# Altium project 2m_DBoard_RX.PrjPcb (part 2 of 2)

## Sheet IF_RX.SchDoc: {Наименование}
size 420 x 297 mm; DocumentNumber: НРДЦ.ХХХХХХ.ХХХ ХХ; SheetNumber: {}; SheetTotal: {}; PageSetup: Record=PageOptions|CenterHorizontal=False|CenterVertical=False|PrintScale=0.95|XCorrection=0.00|YCorrection=0.00|PrintKind=1|BorderSize=5000000|LeftOffset=0|BottomOffset=0|Orientation=1|PaperLength=1000|PaperWidth=1000|Scale=100|PaperSource=15|PrintQuality=600|MediaType=1|DitherType=10|PaperKind=A4|PrintScaleMode=1; Rule: PcbType=ProtelPcb
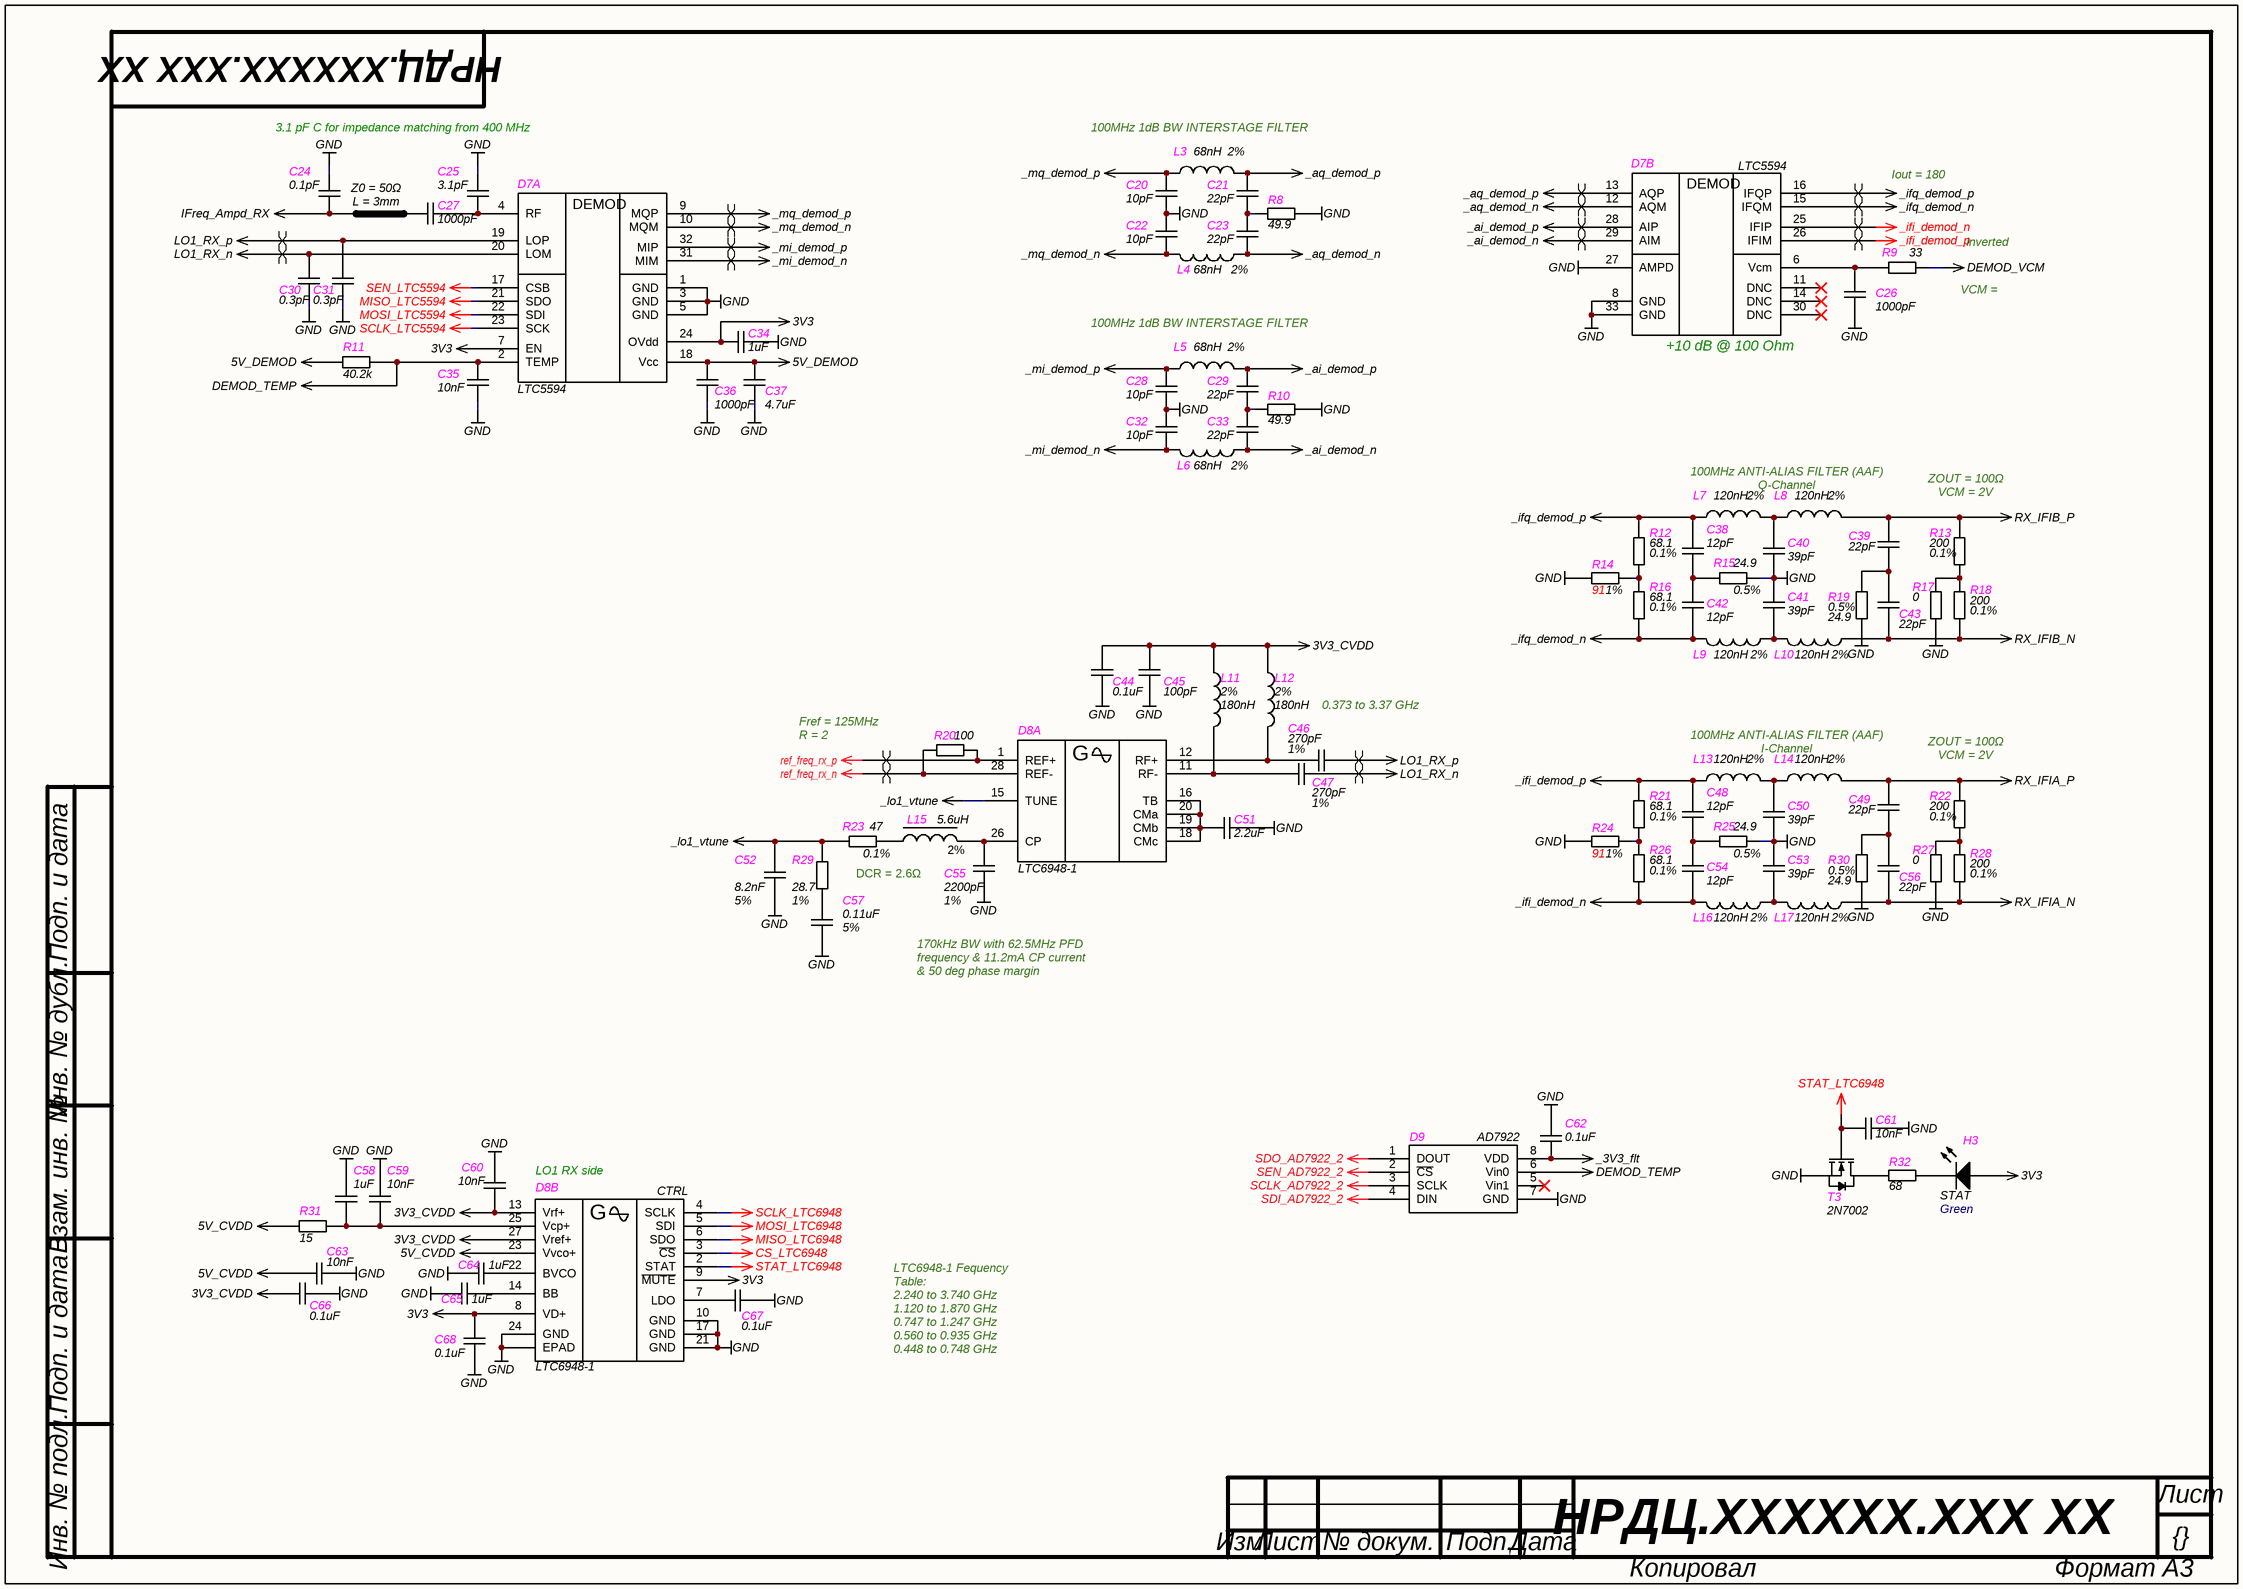
[diagram p3: IF_RX.SchDoc]

### Parts
C20  value 10pF  [C0402]  (hidden comment: CAP)
C21  value 22pF  [C0402]  (hidden comment: CAP)
C22  value 10pF  [C0402]  (hidden comment: CAP)
C23  value 22pF  [C0402]  (hidden comment: CAP)
C24  value 0.1pF  [C0402]  (hidden comment: CAP)
C25  value 3.1pF  [C0402]  (hidden comment: CAP)
C26  value 1000pF  [C0402]  (hidden comment: CAP)
C27  value 1000pF  [C0402]  (hidden comment: CAP)
C28  value 10pF  [C0402]  (hidden comment: CAP)
C29  value 22pF  [C0402]  (hidden comment: CAP)
C30  value 0.3pF  [C0402]  (hidden comment: CAP)
C31  value 0.3pF  [C0402]  (hidden comment: CAP)
C32  value 10pF  [C0402]  (hidden comment: CAP)
C33  value 22pF  [C0402]  (hidden comment: CAP)
C34  value 1uF  [C0402]  (hidden comment: CAP)
C35  value 10nF  [C0402]  (hidden comment: CAP)
C36  value 1000pF  [C0402]  (hidden comment: CAP)
C37  value 4.7uF  [C0805]  (hidden comment: CAP)
C38  value 12pF  [C0402]  (hidden comment: CAP)
C39  value 22pF  [C0402]  (hidden comment: CAP)
C40  value 39pF  [C0402]  (hidden comment: CAP)
C41  value 39pF  [C0402]  (hidden comment: CAP)
C42  value 12pF  [C0402]  (hidden comment: CAP)
C43  value 22pF  [C0402]  (hidden comment: CAP)
C44  value 0.1uF  [C0402]  (hidden comment: CAP)
C45  value 100pF  [C0402]  (hidden comment: CAP)
C46  value 270pF  Tolerance: 1%  [C0402]  (hidden comment: CAP)
C47  value 270pF  Tolerance: 1%  [C0402]  (hidden comment: CAP)
C48  value 12pF  [C0402]  (hidden comment: CAP)
C49  value 22pF  [C0402]  (hidden comment: CAP)
C50  value 39pF  [C0402]  (hidden comment: CAP)
C51  value 2.2uF  [C0603]  (hidden comment: CAP)
C52  value 8.2nF  Tolerance: 5%  [C0603]  (hidden comment: CAP)
C53  value 39pF  [C0402]  (hidden comment: CAP)
C54  value 12pF  [C0402]  (hidden comment: CAP)
C55  value 2200pF  Tolerance: 1%  [C0603]  (hidden comment: CAP)
C56  value 22pF  [C0402]  (hidden comment: CAP)
C57  value 0.11uF  Tolerance: 5%  [C0805]  (hidden comment: CAP)
C58  value 1uF  [C0402]  (hidden comment: CAP)
C59  value 10nF  [C0402]  (hidden comment: CAP)
C60  value 10nF  [C0402]  (hidden comment: CAP)
C61  value 10nF  [C0402]  (hidden comment: CAP)
C62  value 0.1uF  [C0402]  (hidden comment: CAP)
C63  value 10nF  [C0402]  (hidden comment: CAP)
C64  value 1uF  [C0402]  (hidden comment: CAP)
C65  value 1uF  [C0402]  (hidden comment: CAP)
C66  value 0.1uF  [C0402]  (hidden comment: CAP)
C67  value 0.1uF  [C0402]  (hidden comment: CAP)
C68  value 0.1uF  [C0402]  (hidden comment: CAP)
D7  LTC5594  [QFN-32]  (parts A,B of 2)
D8  LTC6948-1  [QFN-28]  (parts A,B of 2)
D9  AD7922  [MSOP-8]
H3  STAT  Color: Green  [LED_0805_Green]
L3  value 68nH  Tolerance: 2%  [L0402HPH]  (hidden comment: Inductor RF)
L4  value 68nH  Tolerance: 2%  [L0402HPH]  (hidden comment: Inductor RF)
L5  value 68nH  Tolerance: 2%  [L0402HPH]  (hidden comment: Inductor RF)
L6  value 68nH  Tolerance: 2%  [L0402HPH]  (hidden comment: Inductor RF)
L7  value 120nH  Tolerance: 2%  [L0402HPH]  (hidden comment: Inductor RF)
L8  value 120nH  Tolerance: 2%  [L0402HPH]  (hidden comment: Inductor RF)
L9  value 120nH  Tolerance: 2%  [L0402HPH]  (hidden comment: Inductor RF)
L10  value 120nH  Tolerance: 2%  [L0402HPH]  (hidden comment: Inductor RF)
L11  value 180nH  Tolerance: 2%  [L0603_HP]  (hidden comment: Inductor RF)
L12  value 180nH  Tolerance: 2%  [L0603_HP]  (hidden comment: Inductor RF)
L13  value 120nH  Tolerance: 2%  [L0402HPH]  (hidden comment: Inductor RF)
L14  value 120nH  Tolerance: 2%  [L0402HPH]  (hidden comment: Inductor RF)
L15  value 5.6uH  Tolerance: 2%  [L1008_LS]  (hidden comment: Inductor)
L16  value 120nH  Tolerance: 2%  [L0402HPH]  (hidden comment: Inductor RF)
L17  value 120nH  Tolerance: 2%  [L0402HPH]  (hidden comment: Inductor RF)
R8  value 49.9  [R0402]  (hidden comment: RES)
R9  value 33  [R0402]  (hidden comment: RES)
R10  value 49.9  [R0402]  (hidden comment: RES)
R11  value 40.2k  [R0402]  (hidden comment: RES)
R12  value 68.1  Tolerance: 0.1%  [R0402]  (hidden comment: RES)
R13  value 200  Tolerance: 0.1%  [R0402]  (hidden comment: RES)
R14  value 91  Tolerance: 1%  [R0402]  (hidden comment: RES)
R15  value 24.9  Tolerance: 0.5%  [R0402]  (hidden comment: RES)
R16  value 68.1  Tolerance: 0.1%  [R0402]  (hidden comment: RES)
R17  value 0  [R0402]  (hidden comment: RES)
R18  value 200  Tolerance: 0.1%  [R0402]  (hidden comment: RES)
R19  value 24.9  Tolerance: 0.5%  [R0402]  (hidden comment: RES)
R20  value 100  [R0402]  (hidden comment: RES)
R21  value 68.1  Tolerance: 0.1%  [R0402]  (hidden comment: RES)
R22  value 200  Tolerance: 0.1%  [R0402]  (hidden comment: RES)
R23  value 47  Tolerance: 0.1%  [R0402]  (hidden comment: RES)
R24  value 91  Tolerance: 1%  [R0402]  (hidden comment: RES)
R25  value 24.9  Tolerance: 0.5%  [R0402]  (hidden comment: RES)
R26  value 68.1  Tolerance: 0.1%  [R0402]  (hidden comment: RES)
R27  value 0  [R0402]  (hidden comment: RES)
R28  value 200  Tolerance: 0.1%  [R0402]  (hidden comment: RES)
R29  value 28.7  Tolerance: 1%  [R0402]  (hidden comment: RES)
R30  value 24.9  Tolerance: 0.5%  [R0402]  (hidden comment: RES)
R31  value 15  [R0603]  (hidden comment: RES)
R32  value 68  [R0402]  (hidden comment: RES)
T3  2N7002  [SOT-23]

### Nets
3V3: C34.1 C68.2 D7.7(EN) D7.24(OVdd) D8.8(VD+) D8.9(~{MUTE}) H3.2(A)
3V3_CVDD: C44.2 C45.2 C60.2 C66.2 D8.13(Vrf+) D8.27(Vref+) L11.2 L12.2
5V_CVDD: C63.1 D8.23(Vvco+) R31.2
5V_DEMOD: C36.1 C37.2 D7.18(Vcc) R11.1
_3V3_flt: C62.1 D9.8(VDD)
_ai_demod_n: C33.2 D7.29(AIM) L6.2
_ai_demod_p: C29.1 D7.28(AIP) L5.2
_aq_demod_n: C23.2 D7.12(AQM) L4.2
_aq_demod_p: C21.1 D7.13(AQP) L3.2
_ifi_demod_n: C54.2 D7.25(IFIP) L16.1 R26.2
_ifi_demod_p: C48.1 D7.26(IFIM) L13.1 R21.1
_ifq_demod_n: C42.2 D7.15(IFQM) L9.1 R16.2
_ifq_demod_p: C38.1 D7.16(IFQP) L7.1 R12.1
_lo1_vtune: C52.2 D8.15(TUNE) R23.2 R29.1
_mi_demod_n: C32.2 D7.31(MIM) L6.1
_mi_demod_p: C28.1 D7.32(MIP) L5.1
_mq_demod_n: C22.2 D7.10(MQM) L4.1
_mq_demod_p: C20.1 D7.9(MQP) L3.1
CS_LTC6948: D8.3(~{CS})
DEMOD_TEMP: C35.1 D7.2(TEMP) D9.6(Vin0) R11.2
DEMOD_VCM: R9.1
GND: C20.2 C22.1 C24.2 C25.2 C26.2 C28.2 C30.2 C31.2 C32.1 C34.2 C35.2 C36.2 C37.1 C40.2 C41.1 C44.1 C45.1 C50.2 C51.1 C52.1 C53.1 C55.1 C57.1 C58.1 C59.1 C60.1 C61.2 C62.2 C63.2 C64.1 C65.2 C66.1 C67.1 C68.1 D7.1(GND) D7.3(GND) D7.5(GND) D7.8(GND) D7.27(AMPD) D7.33(GND) D8.10(GND) D8.17(GND) D8.21(GND) D8.24(GND) D8.29(EPAD) D9.7(GND) R8.2 R10.2 R14.1 R15.2 R17.2 R19.2 R24.1 R25.2 R27.2 R30.2 T3.2(S)
IFreq_Ampd_RX: C24.1 C27.2
LO1_RX_n: C30.1 C47.2 D7.20(LOM)
LO1_RX_p: C31.1 C46.2 D7.19(LOP)
MISO_LTC5594: D7.21(SDO)
MISO_LTC6948: D8.6(SDO)
MOSI_LTC5594: D7.22(SDI)
MOSI_LTC6948: D8.5(SDI)
ref_freq_rx_n: D8.28(REF-) R20.1
ref_freq_rx_p: D8.1(REF+) R20.2
RX_IFIA_N: C56.2 L17.2 R28.2
RX_IFIA_P: C49.1 L14.2 R22.1
RX_IFIB_N: C43.2 L10.2 R18.2
RX_IFIB_P: C39.1 L8.2 R13.1
SCLK_AD7922_2: D9.3(SCLK)
SCLK_LTC5594: D7.23(SCK)
SCLK_LTC6948: D8.4(SCLK)
SDI_AD7922_2: D9.4(DIN)
SDO_AD7922_2: D9.1(DOUT)
SEN_AD7922_2: D9.2(~{CS})
SEN_LTC5594: D7.17(CSB)
STAT_LTC6948: C61.1 D8.2(STAT) T3.1(G)
NetC21_2: C21.2 C23.1 R8.1
NetC25_1: C25.1 C27.1 D7.4(RF)
NetC26_1: C26.1 D7.6(Vcm) R9.2
NetC29_2: C29.2 C33.1 R10.1
NetC38_2: C38.2 C42.1 R15.1
NetC39_2: C39.2 C43.1 R19.1
NetC40_1: C40.1 L7.2 L8.1
NetC41_2: C41.2 L9.2 L10.1
NetC46_1: C46.1 D8.12(RF+) L12.1
NetC47_1: C47.1 D8.11(RF-) L11.1
NetC48_2: C48.2 C54.1 R25.1
NetC49_2: C49.2 C56.1 R30.1
NetC50_1: C50.1 L13.2 L14.1
NetC51_2: C51.2 D8.16(TB) D8.18(CMc) D8.19(CMb) D8.20(CMa)
NetC53_2: C53.2 L16.2 L17.1
NetC55_2: C55.2 D8.26(CP) L15.2
NetC57_2: C57.2 R29.2
NetC58_2: C58.2 C59.2 D8.25(Vcp+) R31.1
NetC64_2: C64.2 D8.22(BVCO)
NetC65_1: C65.1 D8.14(BB)
NetC67_2: C67.2 D8.7(LDO)
NetH3_1: H3.1(K) R32.2
NetL15_1: L15.1 R23.1
NetR12_2: R12.2 R14.2 R16.1
NetR13_2: R13.2 R17.1 R18.1
NetR21_2: R21.2 R24.2 R26.1
NetR22_2: R22.2 R27.1 R28.1
NetR32_1: R32.1 T3.3(D)

Not connected (* = marked no-connect by the designer): D7 11(DNC)* 14(DNC)* 30(DNC)*; D9 5(Vin1)*

### Layout directives
differential pair: _ai_demod_n, _ai_demod_p, _aq_demod_n, _aq_demod_p, _ifi_demod_n, _ifi_demod_p, _ifq_demod_n, _ifq_demod_p, _mi_demod_n, _mi_demod_p, _mq_demod_n, _mq_demod_p, LO1_RX_n, LO1_RX_p, ref_freq_rx_n, ref_freq_rx_p

### Notes on the sheet
- 3.1 pF C for impedance matching from 400 MHz
- 100MHz 1dB BW INTERSTAGE FILTER Q-Channel
- Iout = 180 mA
- Z0 = 50Ω
  L = 3mm
- inverted
- (near R9) VCM = 2V
- 100MHz 1dB BW INTERSTAGE FILTER I-Channel
- 100MHz ANTI-ALIAS FILTER (AAF) Q-Channel
- ZOUT = 100Ω
  VCM = 2V
- 0.373 to 3.37 GHz
- (near R20) Fref = 125MHz
  R = 2
- 100MHz ANTI-ALIAS FILTER (AAF) I-Channel
- DCR = 2.6Ω
- 170kHz BW with 62.5MHz PFD frequency & 11.2mA CP current & 50 deg phase margin
- LO1 RX side
- LTC6948-1 Fequency Table:
  2.240 to 3.740 GHz
  1.120 to 1.870 GHz
  0.747 to 1.247 GHz
  0.560 to 0.935 GHz
  0.448 to 0.748 GHz
  0.373 to 0.623 GHz
- Подп. и дата
- Инв. № дубл.
- Взам. инв. №
- Инв. № подл.
- Лист
- Изм.
- № докум.
- Подп.
- Дата
- Копировал
- Формат А3
- (in symbol LTC5594, part A) DEMOD
- (in symbol LTC5594, part B) DEMOD; +10 dB @ 100 Ohm
- (in symbol LTC6948, part A) G
- (in symbol LTC6948, part B) CTRL; G

### Library data of the parts
C20 C22 C28 C32 = CAP: SMD Capacitor; Manufacturer: Murata; Material: NP0; Tolerance: 1%; Voltage: 50V; Type: Ceramic Capacitor; P/N: GRM1555C1H100FA01D; Supplier 1: Digi-key; Supplier Part Number 1: 490-6186-1-ND; Supplier 2: Mouser; Supplier Part Number 2: 81-GRM1555C1H100FA1D; Supplier 3: Farnell; Supplier Part Number 3: *
C21 C23 C29 C33 C39 C43 C49 C56 = CAP: SMD Capacitor; Manufacturer: Murata; Material: NP0; Tolerance: 1%; Voltage: 50V; Type: Ceramic Capacitor; P/N: GRM1555C1H220FA01D; Supplier 1: Digi-key; Supplier Part Number 1: 490-8589-1-ND; Supplier 2: Mouser; Supplier Part Number 2: 81-GRM1555C1H220FA1D; Supplier 3: Farnell; Supplier Part Number 3: *
C24 = CAP: SMD Capacitor; Manufacturer: Murata; Material: NP0; Tolerance: ±0.05pF; Voltage: 50V; Type: Ceramic Capacitor; P/N: GRM1555C1HR10WA01D; Supplier 1: Digi-key; Supplier Part Number 1: 490-6259-1-ND; Supplier 2: Mouser; Supplier Part Number 2: 81-GRM1555C1HR10WA1D; Supplier 3: Farnell; Supplier Part Number 3: *
C25 = CAP: SMD Capacitor; Manufacturer: Murata; Material: NP0; Tolerance: ±0.05pF; Voltage: 50V; Type: Ceramic Capacitor; P/N: GJM1555C1H3R1WB01D; Supplier 1: Digi-key; Supplier Part Number 1: 490-GJM1555C1H3R1WB01DCT-ND; Supplier 2: Mouser; Supplier Part Number 2: 81-GJM1555C1H3R1WB1D; Supplier 3: Farnell; Supplier Part Number 3: *
C26 C27 C36 = CAP: SMD Capacitor; Manufacturer: Murata; Material: NP0; Tolerance: 5%; Voltage: 50V; Type: Ceramic Capacitor; P/N: GRM1555C1H102JA01D; Supplier 1: Digi-key; Supplier Part Number 1: 490-3244-1-ND; Supplier 2: Mouser; Supplier Part Number 2: 81-GRM1555C1H102JA1D; Supplier 3: Farnell; Supplier Part Number 3: *
C30 C31 = CAP: SMD Capacitor; Manufacturer: Murata; Material: NP0; Tolerance: ±0.05pF; Voltage: 50V; Type: Ceramic Capacitor; P/N: GRM1555C1HR30WA01D; Supplier 1: Digi-key; Supplier Part Number 1: 490-6261-1-ND; Supplier 2: Mouser; Supplier Part Number 2: 81-GRM1555C1HR30WA1D; Supplier 3: Farnell; Supplier Part Number 3: *
C34 C58 C64 C65 = CAP: SMD Capacitor; Manufacturer: Murata; Material: X7R; Tolerance: 10%; Voltage: 6.3V; Type: Ceramic Capacitor; P/N: GRM155R70J105KA12J; Supplier 1: Digi-key; Supplier Part Number 1: 490-13339-1-ND; Supplier 2: Mouser; Supplier Part Number 2: 81-GRM155R70J105KA2J; Supplier 3: Farnell; Supplier Part Number 3: *
C35 C59-C61 C63 = CAP: SMD Capacitor; Manufacturer: Murata; Material: X7R; Tolerance: 10%; Voltage: 25V; Type: Ceramic Capacitor; P/N: GRM155R71E103KA01D; Supplier 1: Digi-key; Supplier Part Number 1: 490-1312-1-ND; Supplier 2: Mouser; Supplier Part Number 2: 81-GRM36X103K25; Supplier 3: Farnell; Supplier Part Number 3: *
C37 = CAP: SMD Capacitor; Manufacturer: Murata; Material: X5R; Tolerance: 10%; Voltage: 50V; Type: Ceramic Capacitor; P/N: GRM21BR61H475KE51L; Supplier 1: Digi-key; Supplier Part Number 1: 490-10751-1-ND; Supplier 2: Mouser; Supplier Part Number 2: 81-GRM21BR61H475KE1L; Supplier 3: Farnell; Supplier Part Number 3: *
C38 C42 C48 C54 = CAP: SMD Capacitor; Manufacturer: Murata; Material: NP0; Tolerance: 1%; Voltage: 50V; Type: Ceramic Capacitor; P/N: GRM1555C1H120FA01D; Supplier 1: Digi-key; Supplier Part Number 1: 490-6196-1-ND; Supplier 2: Mouser; Supplier Part Number 2: 81-GRM1555C1H120FA1D; Supplier 3: Farnell; Supplier Part Number 3: *
C40 C41 C50 C53 = CAP: SMD Capacitor; Manufacturer: Murata; Material: NP0; Tolerance: 1%; Voltage: 50V; Type: Ceramic Capacitor; P/N: GRM1555C1H390FA01D; Supplier 1: Digi-key; Supplier Part Number 1: 490-9663-1-ND; Supplier 2: Mouser; Supplier Part Number 2: 81-GRM1555C1H390FA1D; Supplier 3: Farnell; Supplier Part Number 3: *
C44 C62 C66-C68 = CAP: SMD Capacitor; Manufacturer: Murata; Material: X7R; Tolerance: 10%; Voltage: 10V; Type: Ceramic Capacitor; P/N: GRM155R71A104KA01J; Supplier 1: Digi-key; Supplier Part Number 1: 490-6322-1-ND; Supplier 2: Mouser; Supplier Part Number 2: 81-GRM155R71A104KA1J; Supplier 3: Farnell; Supplier Part Number 3: *
C45 = CAP: SMD Capacitor; Manufacturer: Murata; Material: NP0; Tolerance: 1%; Voltage: 50V; Type: Ceramic Capacitor; P/N: GRM1555C1H101FA01D; Supplier 1: Digi-key; Supplier Part Number 1: 490-8180-1-ND; Supplier 2: Mouser; Supplier Part Number 2: 81-GRM1555C1H101FA1D; Supplier 3: Farnell; Supplier Part Number 3: *
C46 C47 = CAP: SMD Capacitor; Manufacturer: Murata; Material: NP0; Voltage: 50V; Type: Ceramic Capacitor; P/N: GRM1555C1H271FA01D; Supplier 1: Digi-key; Supplier Part Number 1: 490-10686-1-ND; Supplier 2: Mouser; Supplier Part Number 2: 81-GRM1555C1H271FA1D; Supplier 3: Farnell; Supplier Part Number 3: *
C51 = CAP: SMD Capacitor; Manufacturer: Murata; Material: X7R; Tolerance: 10%; Voltage: 10V; Type: Ceramic Capacitor; P/N: GRM188R71A225KE15J; Supplier 1: Digi-key; Supplier Part Number 1: 490-6418-1-ND; Supplier 2: Mouser; Supplier Part Number 2: 81-GRM188R71A225KE5J; Supplier 3: Farnell; Supplier Part Number 3: *
C52 = CAP: SMD Capacitor; Manufacturer: Murata; Material: NP0; Voltage: 50V; Type: Ceramic Capacitor; P/N: GRM1885C1H822JA01D; Supplier 1: Digi-key; Supplier Part Number 1: 490-11482-1-ND; Supplier 2: Mouser; Supplier Part Number 2: 81-GRM1885C1H822JA1D; Supplier 3: Farnell; Supplier Part Number 3: *
C55 = CAP: SMD Capacitor; Manufacturer: Murata; Material: NP0; Voltage: 50V; Type: Ceramic Capacitor; P/N: GCM1885C1H222FA16D; Supplier 1: Digi-key; Supplier Part Number 1: 490-16421-1-ND; Supplier 2: Mouser; Supplier Part Number 2: 81-GCM1885C1H222FA6D; Supplier 3: Farnell; Supplier Part Number 3: *
C57 = CAP: SMD Capacitor; Manufacturer: Murata; Material: NP0; Voltage: 50V; Type: Ceramic Capacitor; P/N: GRM2195C1H113JA01D; Supplier 1: Digi-key; Supplier Part Number 1: 490-8297-1-ND; Supplier 2: Mouser; Supplier Part Number 2: 81-GRM2195C1H113JA1D; Supplier 3: Farnell; Supplier Part Number 3: *
D7 = LTC5594: Quadrature Demodulator; Manufacturer: Analog Devices; Type: High Linearity  I/Q Demodulator; P/N: LTC5594IUH#PBF; Name: LTC5594; Package: 32-Lead 5mm × 5mm QFN; Temperature Range: –40°C to 125°C; Supplier 1: Digi-Key; Supplier Part Number 1: LTC5594IUH#TRPBF-ND; Supplier 2: Mouser; Supplier Part Number 2: 584-LTC5594IUHPBF; Supplier 3: Farnell; Supplier Part Number 3: 4034017
D8 = LTC6948: The LTC®LTC6948 is a high performance, low noise, 6.39GHz  phase-locked loop (PLL); Manufacturer: Linear Technology; Voltage: 3.15 V ~ 5.25 V; Type: Clock/Frequency Synthesizer (RF/IF), Integer N; P/N: LTC6948IUFD-1; Package: 28-QFN (4x5); Temperature Range: -40°C ~ 105°C; Supplier 1: Digi-Key; Supplier Part Number 1: 505-LTC6948IUFD-1#TRPBFCT-ND; Name: LTC6948-1; Supplier 2: Mouser; Supplier Part Number 2: 584-LTC6948IUFD-1PBF; Supplier 3: Farnell; Supplier Part Number 3: *
D9 = AD79x2: 1 MSPS, 10-/12-Bit ADC; Manufacturer: Analog Device; Fast throughput rate: 1MHz; High speed serial interface: SPI®/QSPI™/MICROWIRE™/DSP compatible; Name: AD7922ARM; Type: 2-Channel, 2.35 V to 5.25 V,1 MSPS, 10-/12-Bit ADC; Voltage: 2.35 V to 5.25 V; P/N: AD7922ARMZ; Package: MSOP-8; Supplier 1: Digi-key; Supplier Part Number 1: 505-AD7922ARMZ-ND; Supplier 2: Mouser; Supplier Part Number 2: 584-AD7922ARMZ; Supplier 3: Farnell; Supplier Part Number 3: *; Value: AD7922
H3 = LED: CHIP LED LAMP; Manufacturer: Kingbright; Name: APHCM2012; P/N: APHCM2012CGCK-F01; Package: 2.0 x 1.25 mm SMD; Type: CHIP LED LAMP; Supplier 1: Digi-Key; Supplier Part Number 1: 754-1094-1-ND; Supplier 2: Mouser; Supplier Part Number 2: 604-APHCM2012CGCK; Supplier 3: Farnell; Supplier Part Number 3: *
L3-L6 = Inductor RF: Chip SMD Inductor; Manufacturer: Coilcraft; Current: 320mA; Frequency: 1.84GHz; Name: 0402HPH-68NXGL; P/N: 0402HPH-68NXGLW; Series: 0402HP; Temperature Range: -25…85°C; Supplier 1: Digi-key; Supplier Part Number 1: *; Supplier 2: Mouser; Supplier Part Number 2: 994-0402HPH-68NXGLW; Supplier 3: Farnell; Supplier Part Number 3: 2285859
L7-L10 L13 L14 L16 L17 = Inductor RF: Chip SMD Inductor; Manufacturer: Coilcraft; Current: 310mA; Frequency: 1.25GHz; Name: 0402HPH-R12XGL; P/N: 0402HPH-R12XGLW; Series: 0402HP; Temperature Range: -25…85°C; Supplier 1: Digi-key; Supplier Part Number 1: *; Supplier 2: Mouser; Supplier Part Number 2: 994-0402HPH-R12XGLW; Supplier 3: Farnell; Supplier Part Number 3: 2285863
L11 L12 = Inductor RF: Chip SMD Inductor; Manufacturer: Coilcraft; Current: 310mA; Frequency: 1.5GHz; Name: 0603HP-R18XG; P/N: 0603HP-R18XGL; Series: 0603HP; Temperature Range: -25…85°C; Supplier 1: Digi-key; Supplier Part Number 1: *; Supplier 2: Mouser; Supplier Part Number 2: 994-0603HP-R18XGLW; Supplier 3: Farnell; Supplier Part Number 3: 2286173
L15 = Inductor: Chip SMD Inductor; Manufacturer: Coilcraft; Current: 240mA; Frequency: 32MHz; Name: 1008LS; P/N: 1008LS-562XJLC; DCR: 1.82Ω; Series: 1008LS; Temperature Range: -25…85°C; Supplier 1: Digi-key; Supplier Part Number 1: *; Supplier 2: Mouser; Supplier Part Number 2: 994-1008LS-562XJLC; Supplier 3: Farnell; Supplier Part Number 3: 2286847
R8 R10 = RES: SMD Resistor; Manufacturer: Panasonic Electronic Components; Name: Chip SMD Resistor; Power: 0.063 Wt; Tolerance: 0.5%; P/N: ERJ-2RKD49R9X; Temperature Range: -55…155°C; Supplier 1: Digi-key; Supplier Part Number 1: P15987CT-ND; Supplier 2: Mouser; Supplier Part Number 2: 667-ERJ-2RKD49R9X; Supplier 3: Farnell; Supplier Part Number 3: *
R9 = RES: SMD Resistor; Name: Chip SMD Resistor; Power: 0.1 Wt; Tolerance: 1%; P/N: ERJ-2RKF33R0X; Temperature Range: -55…155°C; Supplier 1: Digi-key; Supplier Part Number 1: P33.0LCT-ND; Supplier 2: Mouser; Supplier Part Number 2: 667-ERJ-2RKF33R0X; Supplier 3: Farnell; Supplier Part Number 3: *
R11 = RES: SMD Resistor; Manufacturer: Panasonic Electronic Components; Name: Chip SMD Resistor; Power: 0.063 Wt; Tolerance: 1%; P/N: ERJ-2RKF4022X; Temperature Range: -55…155°C; Supplier 1: Digi-key; Supplier Part Number 1: P40.2KLCT-ND; Supplier 2: Mouser; Supplier Part Number 2: 667-ERJ-2RKF4022X; Supplier 3: Farnell; Supplier Part Number 3: *
R12 R16 R21 R26 = RES: SMD Resistor; Manufacturer: Panasonic Electronic Components; Name: Chip SMD Resistor; Power: 0.063 Wt; P/N: ERA-2AEB68R1X; Temperature Range: -55…155°C; Supplier 1: Digi-key; Supplier Part Number 1: P68.1DCCT-ND; Supplier 2: Mouser; Supplier Part Number 2: 667-ERA-2AEB68R1X; Supplier 3: Farnell; Supplier Part Number 3: *
R13 R18 R22 R28 = RES: SMD Resistor; Manufacturer: Panasonic Electronic Components; Name: Chip SMD Resistor; Power: 0.063 Wt; P/N: ERA-2AEB201X; Temperature Range: -55…155°C; Supplier 1: Digi-key; Supplier Part Number 1: P200DCCT-ND; Supplier 2: Mouser; Supplier Part Number 2: 667-ERA-2AEB201X; Supplier 3: Farnell; Supplier Part Number 3: *
R14 R24 = RES: SMD Resistor; Manufacturer: Panasonic Electronic Components; Name: Chip SMD Resistor; Power: 1/5 Wt; P/N: ERJ-PA2F91R0X; Temperature Range: -55…155°C; Supplier 1: Digi-key; Supplier Part Number 1: P124516CT-ND; Supplier 2: Mouser; Supplier Part Number 2: 667-ERJ-PA2F91R0X; Supplier 3: Farnell; Supplier Part Number 3: *
R15 R19 R25 R30 = RES: SMD Resistor; Manufacturer: Panasonic Electronic Components; Name: Chip SMD Resistor; Power: 0.063 Wt; P/N: ERJ-2RKD24R9X; Temperature Range: -55…155°C; Supplier 1: Digi-key; Supplier Part Number 1: *; Supplier 2: Mouser; Supplier Part Number 2: 667-ERJ-2RKD24R9X; Supplier 3: Farnell; Supplier Part Number 3: *
R17 R27 = RES: SMD Resistor; Name: Chip SMD Resistor; Power: 0.1 Wt; Tolerance: 1%; P/N: ERJ-2GE0R00X; Temperature Range: -55…155°C; Supplier 1: Digi-key; Supplier Part Number 1: P0.0JCT-ND; Supplier 2: Mouser; Supplier Part Number 2: 667-ERJ-2GE0R00X; Supplier 3: Farnell; Supplier Part Number 3: *
R20 = RES: SMD Resistor; Manufacturer: Panasonic Electronic Components; Name: Chip SMD Resistor; Power: 0.062 Wt; Tolerance: 5%; P/N: ERJ-2GEJ101X; Temperature Range: -55…155°C; Supplier 1: Digi-key; Supplier Part Number 1: P100JCT-ND; Supplier 2: Mouser; Supplier Part Number 2: 667-ERJ-2GEJ101X; Supplier 3: Farnell; Supplier Part Number 3: *
R23 = RES: SMD Resistor; Manufacturer: Panasonic Electronic Components; Name: Chip SMD Resistor; Power: 0.2 Wt; P/N: ERA-2AEB470X; Temperature Range: -55…155°C; Supplier 1: Digi-key; Supplier Part Number 1: P47DCCT-ND; Supplier 2: Mouser; Supplier Part Number 2: 667-ERA-2AEB470X; Supplier 3: Farnell; Supplier Part Number 3: *
R29 = RES: SMD Resistor; Manufacturer: Panasonic Electronic Components; Name: Chip SMD Resistor; Power: 0.2 Wt; P/N: ERJ-2RKF28R7X; Temperature Range: -55…155°C; Supplier 1: Digi-key; Supplier Part Number 1: P28.7LCT-ND; Supplier 2: Mouser; Supplier Part Number 2: *; Supplier 3: Farnell; Supplier Part Number 3: *
R31 = RES: SMD Resistor; Name: Chip SMD Resistor; Power: 0.1 Wt; Tolerance: 1%; P/N: ERJ-3EKF15R0V; Temperature Range: -55…155°C; Supplier 1: Digi-key; Supplier Part Number 1: P15.0HCT-ND; Supplier 2: Mouser; Supplier Part Number 2: 667-ERJ-3EKF15R0V; Supplier 3: Farnell; Supplier Part Number 3: *
R32 = RES: SMD Resistor; Name: Chip SMD Resistor; Power: 0.062 Wt; Tolerance: 5%; P/N: ERJ-2GEJ680X; Temperature Range: -55…155°C; Supplier 1: Digi-key; Supplier Part Number 1: P68JCT-ND; Supplier 2: Mouser; Supplier Part Number 2: 667-ERJ-2GEJ680X; Supplier 3: Farnell; Supplier Part Number 3: *
T3 = 2N7002: N-Channel MOSFET 2N7002; Channel Resistance: 5Ohm; Current: 300mA; Power Dissipation: 0.83W; Voltage: 60V; P/N: 2N7002NXAKR; Name: 2N7002; Type: SOT-23; Package: SOT-23; Value: 2N7002; Supplier 1: Digi-key; Supplier Part Number 1: 1727-8643-1-ND; Supplier 2: Mouser; Supplier Part Number 2: 771-2N7002NXAKR; Supplier 3: Farnell; Supplier Part Number 3: *

## Sheet DBoard_conn.SchDoc: {Наименование}
size 420 x 297 mm; DocumentNumber: ПЛАС.ХХХХХХ.ХХХ ХХ; SheetNumber: {}; SheetTotal: {}; PageSetup: Record=PageOptions|CenterHorizontal=False|CenterVertical=False|PrintScale=0.95|XCorrection=0.00|YCorrection=0.00|PrintKind=1|BorderSize=5000000|LeftOffset=0|BottomOffset=0|Orientation=1|PaperLength=1000|PaperWidth=1000|Scale=100|PaperSource=15|PrintQuality=600|MediaType=1|DitherType=10|PaperKind=A4|PrintScaleMode=1; Rule: PcbType=ProtelPcb
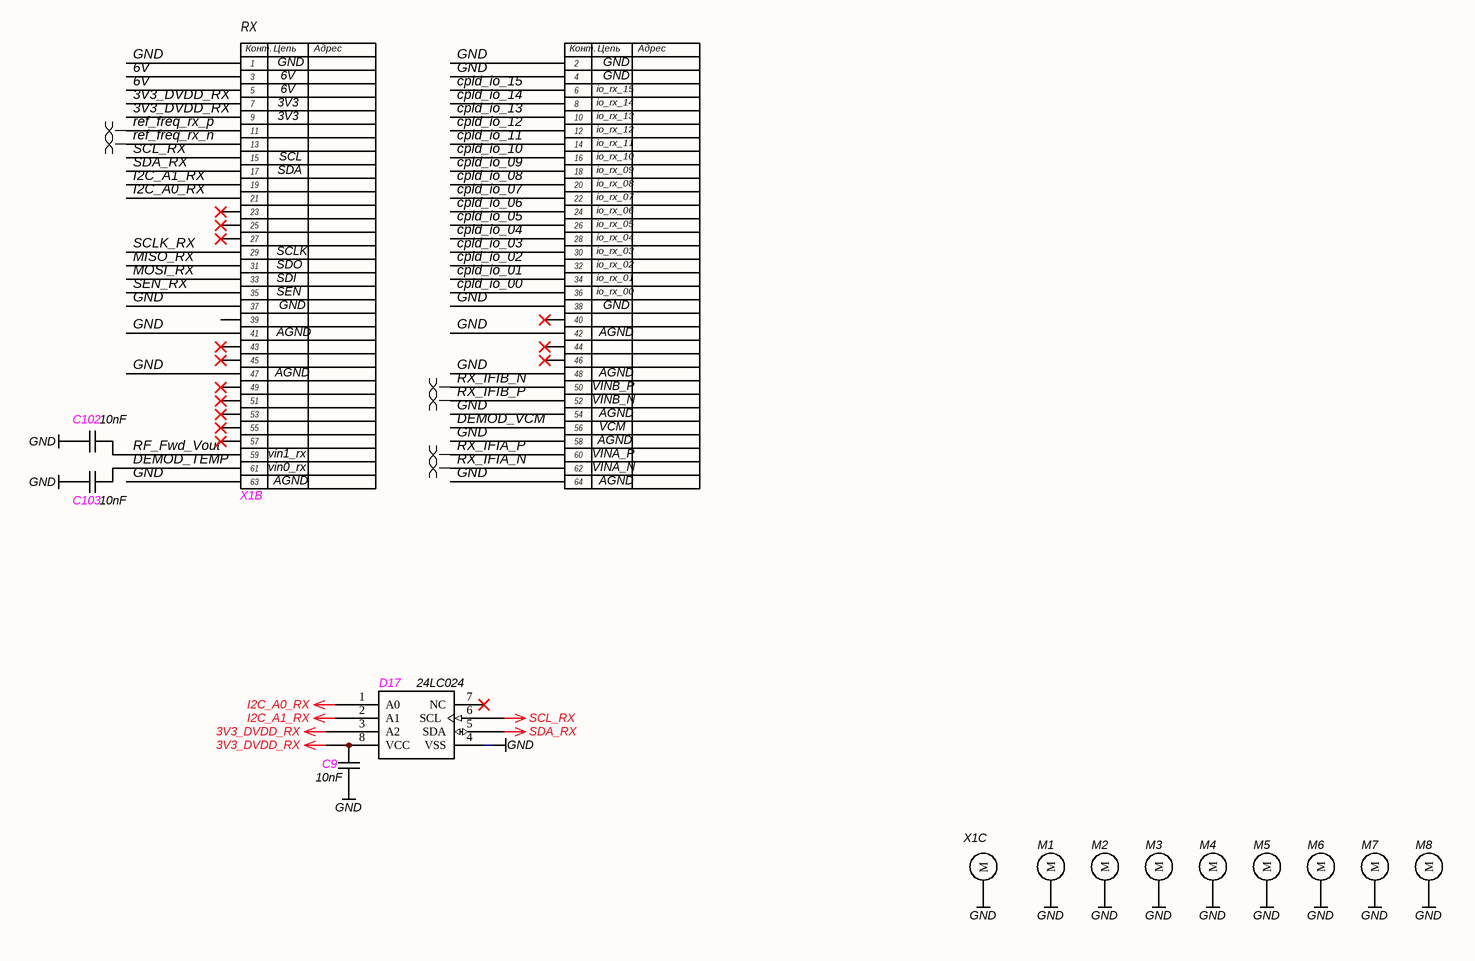
[diagram p4: DBoard_conn.SchDoc]

### Parts
C9  value 10nF  [C0402]  (hidden comment: CAP)
C102  value 10nF  [C0402]  (hidden comment: CAP)
C103  value 10nF  [C0402]  (hidden comment: CAP)
D17  24LC024  [SOIC_SN8]
M1  Via  [Mechanical_Via_2.6x4.2]  (value not drawn)
M2  Via  [Mechanical_Via_2.6x4.2]  (value not drawn)
M3  Via  [Mechanical_Via_2.6x4.2]  (value not drawn)
M4  Via  [Mechanical_Via_2.6x4.2]  (value not drawn)
M5  Via  [Mechanical_Via_2.6x4.2]  (value not drawn)
M6  Via  [Mechanical_Via_2.6x4.2]  (value not drawn)
M7  Via  [Mechanical_Via_2.6x4.2]  (value not drawn)
M8  Via  [Mechanical_Via_2.6x4.2]  (value not drawn)
X1  DBoard  [DBoard - half - MB]  (value not drawn)  (parts B,C of 3)

### Nets
3V3_DVDD_RX: C9.2 D17.3(A2) D17.8(VCC) X1.71(7) X1.73(9)
6V: X1.67(3) X1.69(5)
cpld_io_00: X1.100(36)
cpld_io_01: X1.98(34)
cpld_io_02: X1.96(32)
cpld_io_03: X1.94(30)
cpld_io_04: X1.92(28)
cpld_io_05: X1.90(26)
cpld_io_06: X1.88(24)
cpld_io_07: X1.86(22)
cpld_io_08: X1.84(20)
cpld_io_09: X1.82(18)
cpld_io_10: X1.80(16)
cpld_io_11: X1.78(14)
cpld_io_12: X1.76(12)
cpld_io_13: X1.74(10)
cpld_io_14: X1.72(8)
cpld_io_15: X1.70(6)
DEMOD_TEMP: C103.2 X1.125(61)
DEMOD_VCM: X1.120(56)
GND: C9.1 C102.1 C103.1 D17.4(VSS) M1.0(M) M2.0(M) M3.0(M) M4.0(M) M5.0(M) M6.0(M) M7.0(M) M8.0(M) X1.0(M) X1.65(1) X1.66(2) X1.68(4) X1.101(37) X1.102(38) X1.105(41) X1.106(42) X1.111(47) X1.112(48) X1.118(54) X1.122(58) X1.127(63) X1.128(64)
I2C_A0_RX: D17.1(A0) X1.85(21)
I2C_A1_RX: D17.2(A1) X1.83(19)
MISO_RX: X1.95(31)
MOSI_RX: X1.97(33)
ref_freq_rx_n: X1.77(13)
ref_freq_rx_p: X1.75(11)
RF_Fwd_Vout: C102.2 X1.123(59)
RX_IFIA_N: X1.126(62)
RX_IFIA_P: X1.124(60)
RX_IFIB_N: X1.114(50)
RX_IFIB_P: X1.116(52)
SCL_RX: D17.6(SCL) X1.79(15)
SCLK_RX: X1.93(29)
SDA_RX: D17.5(SDA) X1.81(17)
SEN_RX: X1.99(35)

Not connected (* = marked no-connect by the designer): D17 7(NC)*; X1 87(23)* 89(25)* 91(27)* 103(39) 104(40)* 107(43)* 108(44)* 109(45)* 110(46)* 113(49)* 115(51)* 117(53)* 119(55)* 121(57)*

### Layout directives
differential pair: ref_freq_rx_n, ref_freq_rx_p, RX_IFIA_N, RX_IFIA_P, RX_IFIB_N, RX_IFIB_P

### Notes on the sheet
- (near X1) GND
- (near X1) 3V3
- (near X1) 6V
- (near X1) io_rx_15
- (near X1) io_rx_14
- (near X1) SDA
- (near X1) SCL
- (near X1) io_rx_13
- (near X1) io_rx_12
- (near X1) io_rx_11
- (near X1) io_rx_10
- (near X1) io_rx_09
- (near X1) io_rx_08
- (near X1) io_rx_07
- (near X1) io_rx_06
- (near X1) io_rx_05
- (near X1) io_rx_04
- (near X1) SCLK
- (near X1) SDO
- (near X1) SDI
- (near X1) SEN
- (near X1) io_rx_03
- (near X1) io_rx_02
- (near X1) io_rx_01
- (near X1) io_rx_00
- (near X1) AGND
- (near X1) VINB_P
- (near X1) VINB_N
- (near X1) VCM
- (near X1) vin1_rx
- (near X1) vin0_rx
- (near X1) VINA_P
- (near X1) VINA_N
- Подп. и дата
- Инв. № дубл.
- Взам. инв. №
- Инв. № подл.
- Лист
- Изм.
- № докум.
- Подп.
- Дата
- Копировал
- Формат А3
- (in symbol DBoard, part B) RX; Конт.; Цепь; Адрес
- (in symbol DBoard, part A) TX; Конт.; Цепь; Адрес

### Library data of the parts
C9 C102 C103 = CAP: as C35 on sheet IF_RX; Supplier 1: Digi-key; Supplier Part Number 1: 490-1312-1-ND; Supplier 2: Mouser; Supplier Part Number 2: 81-GRM36X103K25; Supplier 3: Farnell; Supplier Part Number 3: *
D17 = 24LC024: I2C EEPROM; Manufacturer: Microchip; Capacity: 2kbit; Max Clock: 400 kHz; Voltage: 2.5-5.5V; P/N: 24LC024HT-I/SN; Name: 24LC024; Package: SOIC-8; Type: I2C EEPROM; Value: 24LC024; Supplier 1: Digi-key; Supplier Part Number 1: 24LC024HT-I/SNCT-ND; Supplier 2: Mouser; Supplier Part Number 2: 579-24LC024HT-I/SN; Supplier 3: Farnell; Supplier Part Number 3: *
M1-M8 = Mechanical Via: Supplier 4: Digi-key; Supplier Part Number 4: *; Supplier 5: Mouser; Supplier Part Number 5: *; Supplier 6: Farnell; Supplier Part Number 6: *
X1 = DBoard: USRP DBoard; Manufacturer: Molex; Name: 1.00mm Pitch Mezzanine 714390164; P/N: 714390164; Value: Molex 714390164; Supplier 1: Digi-key; Supplier Part Number 1: WM17201-ND; Supplier 2: Mouser; Supplier Part Number 2: 538-71439-0164; Supplier 3: Farnell; Supplier Part Number 3: *

## Nets that join several sheets
3V3: CPLD (41 pins), RX (H1.2 H2.2), Power (C97.2 C98.2 C99.2 L23.2), IF_RX (7 pins)
3V3_CVDD: Power (C76.1 D11.1), IF_RX (8 pins)
5V_AVDD: RX (C14.2 C15.2 L1.2), Power (C87.1 D13.1)
5V_CVDD: Power (C83.1 D12.1), IF_RX (C63.1 D8.23 R31.2)
5V_DEMOD: Power (C101.1 D10.1), IF_RX (C36.1 C37.2 D7.18 R11.1)
6V: Power (9 pins), DBoard_conn (X1.67 X1.69)
12V_AVDD: RX (7 pins), Power (C70.2 C71.2 C72.2 L19.2)
_3V3_flt: RX (13 pins), Power (C90.2 C91.2 C92.2 L22.2), IF_RX (C62.1 D9.8)
ATT1_RX_C1: CPLD (D16.C16), RX (D4.11)
ATT1_RX_C2: CPLD (D16.B16), RX (D4.10)
ATT2_MOSI_RX: CPLD (R91.5), RX (D6.18)
ATT2_RX_LE: CPLD (R91.7), RX (D6.16)
ATT2_SCLK_RX: CPLD (R91.6), RX (D6.17)
cpld_io_00: CPLD (R90.2), DBoard_conn (X1.100)
cpld_io_01: CPLD (R89.6), DBoard_conn (X1.98)
cpld_io_02: CPLD (R89.7), DBoard_conn (X1.96)
cpld_io_03: CPLD (R89.8), DBoard_conn (X1.94)
cpld_io_04: CPLD (R87.5), DBoard_conn (X1.92)
cpld_io_05: CPLD (R87.6), DBoard_conn (X1.90)
cpld_io_06: CPLD (R87.7), DBoard_conn (X1.88)
cpld_io_07: CPLD (R87.8), DBoard_conn (X1.86)
cpld_io_08: CPLD (R84.5), DBoard_conn (X1.84)
cpld_io_09: CPLD (R84.6), DBoard_conn (X1.82)
cpld_io_10: CPLD (R84.7), DBoard_conn (X1.80)
cpld_io_11: CPLD (R84.8), DBoard_conn (X1.78)
cpld_io_12: CPLD (R82.5), DBoard_conn (X1.76)
cpld_io_13: CPLD (R82.6), DBoard_conn (X1.74)
cpld_io_14: CPLD (R82.7), DBoard_conn (X1.72)
cpld_io_15: CPLD (R82.8), DBoard_conn (X1.70)
CS_LTC6948: CPLD (R81.8), IF_RX (D8.3)
DEMOD_TEMP: IF_RX (C35.1 D7.2 D9.6 R11.2), DBoard_conn (C103.2 X1.125)
DEMOD_VCM: IF_RX (R9.1), DBoard_conn (X1.120)
GND: CPLD (47 pins), RX (59 pins), Power (55 pins), IF_RX (57 pins), DBoard_conn (26 pins)
IFreq_Ampd_RX: RX (D6.14), IF_RX (C24.1 C27.2)
LED_RX: CPLD (D16.L16), RX (T2.1)
MISO_LTC5594: CPLD (R80.5), IF_RX (D7.21)
MISO_LTC6948: CPLD (R81.5), IF_RX (D8.6)
MISO_RX: CPLD (R79.7), DBoard_conn (X1.95)
MOSI_LTC5594: CPLD (R80.6), IF_RX (D7.22)
MOSI_LTC6948: CPLD (R81.6), IF_RX (D8.5)
MOSI_RX: CPLD (R79.6), DBoard_conn (X1.97)
ref_freq_rx_n: IF_RX (D8.28 R20.1), DBoard_conn (X1.77)
ref_freq_rx_p: IF_RX (D8.1 R20.2), DBoard_conn (X1.75)
RF_Fwd_Vout: RX (C3.2 D1.5 D2.3), DBoard_conn (C102.2 X1.123)
RX_IFIA_N: IF_RX (C56.2 L17.2 R28.2), DBoard_conn (X1.126)
RX_IFIA_P: IF_RX (C49.1 L14.2 R22.1), DBoard_conn (X1.124)
RX_IFIB_N: IF_RX (C43.2 L10.2 R18.2), DBoard_conn (X1.114)
RX_IFIB_P: IF_RX (C39.1 L8.2 R13.1), DBoard_conn (X1.116)
SCLK_AD7922: CPLD (R86.2), RX (D1.3)
SCLK_AD7922_2: CPLD (R88.6), IF_RX (D9.3)
SCLK_LTC5594: CPLD (R80.7), IF_RX (D7.23)
SCLK_LTC6948: CPLD (R81.7), IF_RX (D8.4)
SCLK_RX: CPLD (R79.8), DBoard_conn (X1.93)
SDI_AD7922: CPLD (R86.1), RX (D1.4)
SDI_AD7922_2: CPLD (R88.5), IF_RX (D9.4)
SDO_AD7922: CPLD (R86.4), RX (D1.1)
SDO_AD7922_2: CPLD (R88.8), IF_RX (D9.1)
SEN_AD7922: CPLD (R86.3), RX (D1.2)
SEN_AD7922_2: CPLD (R88.7), IF_RX (D9.2)
SEN_LTC5594: CPLD (D16.B6), IF_RX (D7.17)
SEN_RX: CPLD (R79.5), DBoard_conn (X1.99)
STAT_LTC6948: CPLD (D16.T6), IF_RX (C61.1 D8.2 T3.1)
TPS_EN: CPLD (D16.K16), RX (T1.1), Power (D14.11)